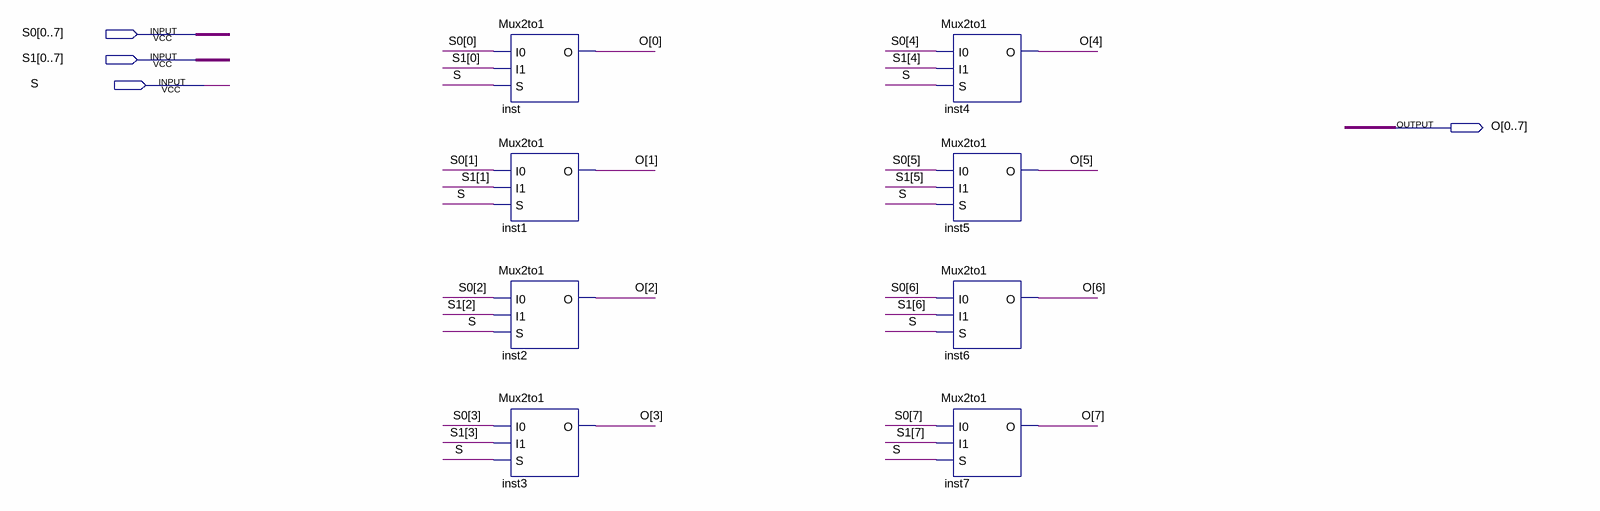
[diagram p0: schematic sheet]
// Quartus schematic MUX8bit.bdf as structural Verilog: 8 symbols, 4 pins
module MUX8bit (
  input  [0:7] S0,
  input  [0:7] S1,
  input  S,
  output [0:7] O
);

  Mux2to1 inst (.I0(S0[0]), .I1(S1[0]), .S(S), .O(O[0]));
  Mux2to1 inst1 (.I0(S0[1]), .I1(S1[1]), .S(S), .O(O[1]));
  Mux2to1 inst2 (.I0(S0[2]), .I1(S1[2]), .S(S), .O(O[2]));
  Mux2to1 inst3 (.I0(S0[3]), .I1(S1[3]), .S(S), .O(O[3]));
  Mux2to1 inst4 (.I0(S0[4]), .I1(S1[4]), .S(S), .O(O[4]));
  Mux2to1 inst5 (.I0(S0[5]), .I1(S1[5]), .S(S), .O(O[5]));
  Mux2to1 inst6 (.I0(S0[6]), .I1(S1[6]), .S(S), .O(O[6]));
  Mux2to1 inst7 (.I0(S0[7]), .I1(S1[7]), .S(S), .O(O[7]));
endmodule
